# Altium project PCB_Project1.PrjPCB
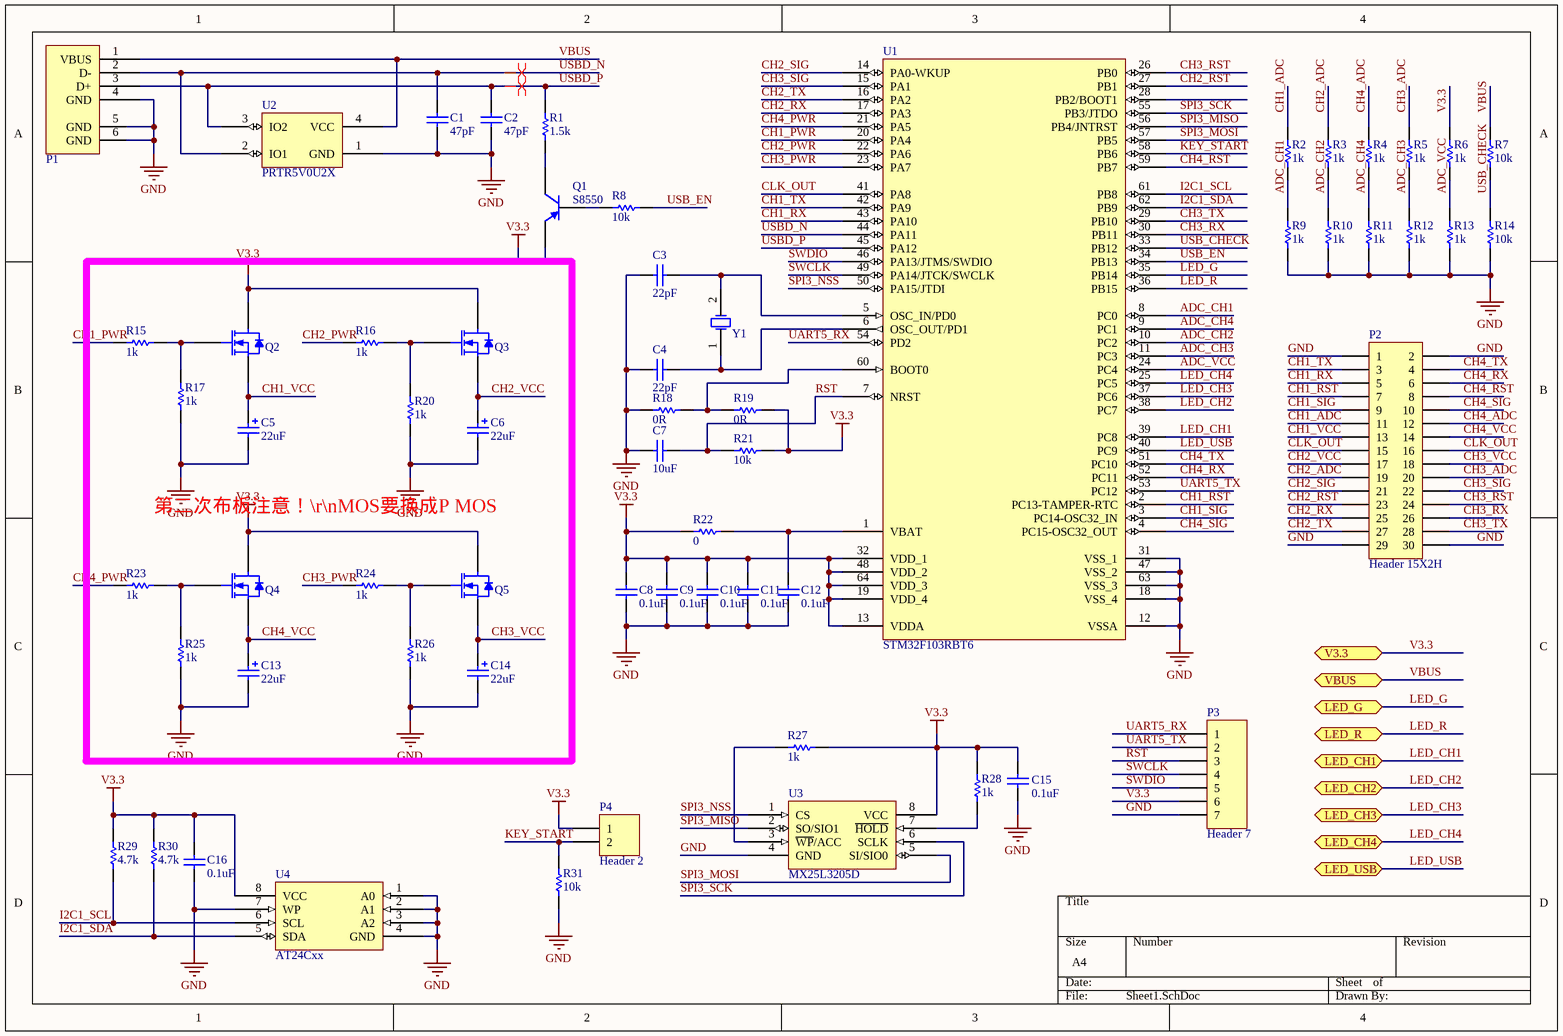
[diagram p0: Sheet1.SchDoc]
2 sheets, 106 parts. Net scope: flat (ports and power ports of the same name join across sheets).
Board file: PCB1.PcbDoc
Sheets:
  Sheet1.SchDoc
  Sheet2.SchDoc

## Sheet Sheet1.SchDoc
size A4

### Parts
C1  value 47pF  [0805]  (hidden comment: Cap)
C2  value 47pF  [0805]  (hidden comment: Cap)
C3  value 22pF  [0805]  (hidden comment: Cap)
C4  value 22pF  [0805]  (hidden comment: Cap)
C5  value 22uF  [0805A]  (hidden comment: Cap)
C6  value 22uF  [0805A]  (hidden comment: Cap)
C7  value 10uF  [0805]  (hidden comment: Cap)
C8  value 0.1uF  [0805]  (hidden comment: Cap)
C9  value 0.1uF  [0805]  (hidden comment: Cap)
C10  value 0.1uF  [0805]  (hidden comment: Cap)
C11  value 0.1uF  [0805]  (hidden comment: Cap)
C12  value 0.1uF  [0805]  (hidden comment: Cap)
C13  value 22uF  [0805A]  (hidden comment: Cap)
C14  value 22uF  [0805A]  (hidden comment: Cap)
C15  value 0.1uF  [0805]  (hidden comment: Cap)
C16  value 0.1uF  [0805]  (hidden comment: Cap)
P1  USB  [USB_B_FE]  (value not drawn)
P2  Header 15X2H  [HDR2X15H]
P3  Header 7  [HDR1X7]
P4  Header 2  [HDR1X2]
Q1  S8550  [SOT-23]
Q2  N-MOS  [SOT-23]  (value not drawn)
Q3  N-MOS  [SOT-23]  (value not drawn)
Q4  N-MOS  [SOT-23]  (value not drawn)
Q5  N-MOS  [SOT-23]  (value not drawn)
R1  value 1.5k  [0805]  (hidden comment: Res)
R2  value 1k  [0805]  (hidden comment: Res)
R3  value 1k  [0805]  (hidden comment: Res)
R4  value 1k  [0805]  (hidden comment: Res)
R5  value 1k  [0805]  (hidden comment: Res)
R6  value 1k  [0805]  (hidden comment: Res)
R7  value 10k  [0805]  (hidden comment: Res)
R8  value 10k  [0805]  (hidden comment: Res)
R9  value 1k  [0805]  (hidden comment: Res)
R10  value 1k  [0805]  (hidden comment: Res)
R11  value 1k  [0805]  (hidden comment: Res)
R12  value 1k  [0805]  (hidden comment: Res)
R13  value 1k  [0805]  (hidden comment: Res)
R14  value 10k  [0805]  (hidden comment: Res)
R15  value 1k  [0805]  (hidden comment: Res)
R16  value 1k  [0805]  (hidden comment: Res)
R17  value 1k  [0805]  (hidden comment: Res)
R18  value 0R  [0805]  (hidden comment: Res)
R19  value 0R  [0805]  (hidden comment: Res)
R20  value 1k  [0805]  (hidden comment: Res)
R21  value 10k  [0805]  (hidden comment: Res)
R22  value 0  [0805]  (hidden comment: Res)
R23  value 1k  [0805]  (hidden comment: Res)
R24  value 1k  [0805]  (hidden comment: Res)
R25  value 1k  [0805]  (hidden comment: Res)
R26  value 1k  [0805]  (hidden comment: Res)
R27  value 1k  [0805]  (hidden comment: Res)
R28  value 1k  [0805]  (hidden comment: Res)
R29  value 4.7k  [0805]  (hidden comment: Res)
R30  value 4.7k  [0805]  (hidden comment: Res)
R31  value 10k  [0805]  (hidden comment: Res)
U1  STM32F103RBT6  [LQFP64_M]
U2  PRTR5V0U2X  [SOT143B]
U3  MX25L3205D  [SOP-8]
U4  AT24Cxx  [SOP-8]
Y1  XTAL2  [SP_XTAL]  (value not drawn)

### Blocks framed on the sheet
第二次布板注意！\r\nMOS要换成P MOS: C5 C6 C13 C14 Q2-Q5 R15-R17 R20 R23-R26

### Ports
LED_CH1, LED_CH2, LED_CH3, LED_CH4, LED_G, LED_R, LED_USB, V3.3, VBUS

### Nets
GND: C1.1 C2.1 C3.1 C4.2 C5.2 C6.2 C7.2 C8.1 C9.1 C10.1 C11.1 C12.1 C13.2 C14.2 C15.1 C16.1 P1.4(GND) P1.5(GND) P1.6(GND) P2.1 P2.2 P2.29 P2.30 P3.7 R9.1 R10.1 R11.1 R12.1 R13.1 R14.1 R17.1 R18.1 R20.2 R25.1 R26.2 R31.1 U1.12(VSSA) U1.18(VSS_4) U1.31(VSS_1) U1.47(VSS_2) U1.63(VSS_3) U2.1(GND) U3.4(GND) U4.1(A0) U4.2(A1) U4.3(A2) U4.4(GND) U4.7(WP)
V3.3: C8.2 C9.2 C10.2 C11.2 C15.2 C16.2 P3.6 P4.1 Q1.2(E) Q2.3(D) Q3.3(D) Q4.3(D) Q5.3(D) R6.2 R19.2 R21.1 R22.1 R27.2 R28.2 R29.2 R30.2 U1.13(VDDA) U1.19(VDD_4) U1.32(VDD_1) U1.48(VDD_2) U1.64(VDD_3) U3.8(VCC) U4.8(VCC) ; port V3.3
ADC_CH1: R2.1 R9.2 U1.8(PC0)
ADC_CH2: R3.1 R10.2 U1.10(PC2)
ADC_CH3: R5.1 R12.2 U1.11(PC3)
ADC_CH4: R4.1 R11.2 U1.9(PC1)
ADC_VCC: R6.1 R13.2 U1.24(PC4)
CH1_ADC: P2.11 R2.2
CH1_PWR: R15.1 U1.20(PA4)
CH1_RST: P2.7 U1.2(PC13-TAMPER-RTC)
CH1_RX: P2.5 U1.43(PA10)
CH1_SIG: P2.9 U1.3(PC14-OSC32_IN)
CH1_TX: P2.3 U1.42(PA9)
CH1_VCC: C5.1 P2.13 Q2.2(S)
CH2_ADC: P2.19 R3.2
CH2_PWR: R16.2 U1.22(PA6)
CH2_RST: P2.23 U1.27(PB1)
CH2_RX: P2.25 U1.17(PA3)
CH2_SIG: P2.21 U1.14(PA0-WKUP)
CH2_TX: P2.27 U1.16(PA2)
CH2_VCC: C6.1 P2.17 Q3.2(S)
CH3_ADC: P2.20 R5.2
CH3_PWR: R24.2 U1.23(PA7)
CH3_RST: P2.24 U1.26(PB0)
CH3_RX: P2.26 U1.30(PB11)
CH3_SIG: P2.22 U1.15(PA1)
CH3_TX: P2.28 U1.29(PB10)
CH3_VCC: C14.1 P2.18 Q5.2(S)
CH4_ADC: P2.12 R4.2
CH4_PWR: R23.1 U1.21(PA5)
CH4_RST: P2.8 U1.59(PB7)
CH4_RX: P2.6 U1.52(PC11)
CH4_SIG: P2.10 U1.4(PC15-OSC32_OUT)
CH4_TX: P2.4 U1.51(PC10)
CH4_VCC: C13.1 P2.14 Q4.2(S)
CLK_OUT: P2.15 P2.16 U1.41(PA8)
I2C1_SCL: R29.1 U1.61(PB8) U4.6(SCL)
I2C1_SDA: R30.1 U1.62(PB9) U4.5(SDA)
KEY_START: P4.2 R31.2 U1.58(PB6)
LED_CH1: U1.39(PC8) ; port LED_CH1
LED_CH2: U1.38(PC7) ; port LED_CH2
LED_CH3: U1.37(PC6) ; port LED_CH3
LED_CH4: U1.25(PC5) ; port LED_CH4
LED_G: U1.35(PB14) ; port LED_G
LED_R: U1.36(PB15) ; port LED_R
LED_USB: U1.40(PC9) ; port LED_USB
RST: C7.1 P3.3 R21.2 U1.7(NRST)
SPI3_MISO: U1.56(PB4/JNTRST) U3.2(SO/SIO1)
SPI3_MOSI: U1.57(PB5) U3.5(SI/SIO0)
SPI3_NSS: U1.50(PA15/JTDI) U3.1(CS)
SPI3_SCK: U1.55(PB3/JTDO) U3.6(SCLK)
SWCLK: P3.4 U1.49(PA14/JTCK/SWCLK)
SWDIO: P3.5 U1.46(PA13/JTMS/SWDIO)
UART5_RX: P3.1 U1.54(PD2)
UART5_TX: P3.2 U1.53(PC12)
USB_CHECK: R7.1 R14.2 U1.33(PB12)
USB_EN: R8.2 U1.34(PB13)
USBD_N: C1.2 P1.2(D-) U1.44(PA11) U2.2(IO1)
USBD_P: C2.2 P1.3(D+) R1.2 U1.45(PA12) U2.3(IO2)
VBUS: P1.1(VBUS) R7.2 U2.4(VCC) ; port VBUS
NetC3_2: C3.2 U1.5(OSC_IN/PD0) Y1.2(OSC2)
NetC4_1: C4.1 U1.6(OSC_OUT/PD1) Y1.1(OSC1)
NetC12_2: C12.2 R22.2 U1.1(VBAT)
NetQ1_1: Q1.1(B) R8.1
NetQ1_3: Q1.3(C) R1.1
NetQ2_1: Q2.1(G) R15.2 R17.2
NetQ3_1: Q3.1(G) R16.1 R20.1
NetQ4_1: Q4.1(G) R23.2 R25.2
NetQ5_1: Q5.1(G) R24.1 R26.1
NetR18_2: R18.2 R19.1 U1.60(BOOT0)
NetR27_1: R27.1 U3.3(~{WP}/ACC)
NetR28_1: R28.1 U3.7(~{HOLD})

Not connected (* = marked no-connect by the designer): U1 28(PB2/BOOT1)

### Layout directives
differential pair: USBD_N, USBD_P

### Library data of the parts
C5 C6 C13 C14 = Cap Pol
P1 = USB Socket
P2 = Header 15X2H: Header, 15-Pin, Dual row, Right Angle; LatestRevisionDate: 17-Jul-2002; LatestRevisionNote: Re-released for DXP Platform.; Publisher: Altium Limited
P3 = Header 7: Header, 7-Pin; LatestRevisionDate: 17-Jul-2002; LatestRevisionNote: Re-released for DXP Platform.; Publisher: Altium Limited
P4 = Header 2: Header, 2-Pin; LatestRevisionDate: 17-Jul-2002; LatestRevisionNote: Re-released for DXP Platform.; Publisher: Altium Limited
U1 = STM32F103RBT6: STM32 ARM-based 32-bit MCU with 128 Kbytes Flash, 64-pin LQFP, Industrial Temperature; Published: 30-May-2008; DatasheetVersion: rev6, Mar-2008; PackageVersion: Mar-2008; PackageReference: LQFP64; Publisher: Altium Limited; PackageDescription: 64-Pin Low-Profile Quad Flat Pack, 10 x 10 mm Body, 0.5 mm Pitch (LQFP64); ComponentLink1Description: Manufacturer Link; ComponentLink1URL: www.st.com/stm32; ComponentLink2Description: Datasheet; ComponentLink2URL: http://www.st.com/stonline/products/literature/ds/13587.pdf
U3 = MX25L1605D/MX25L3205D/MX25L6405D
Y1 = XTAL2: Value: 12MHz

## Sheet Sheet2.SchDoc
size A4
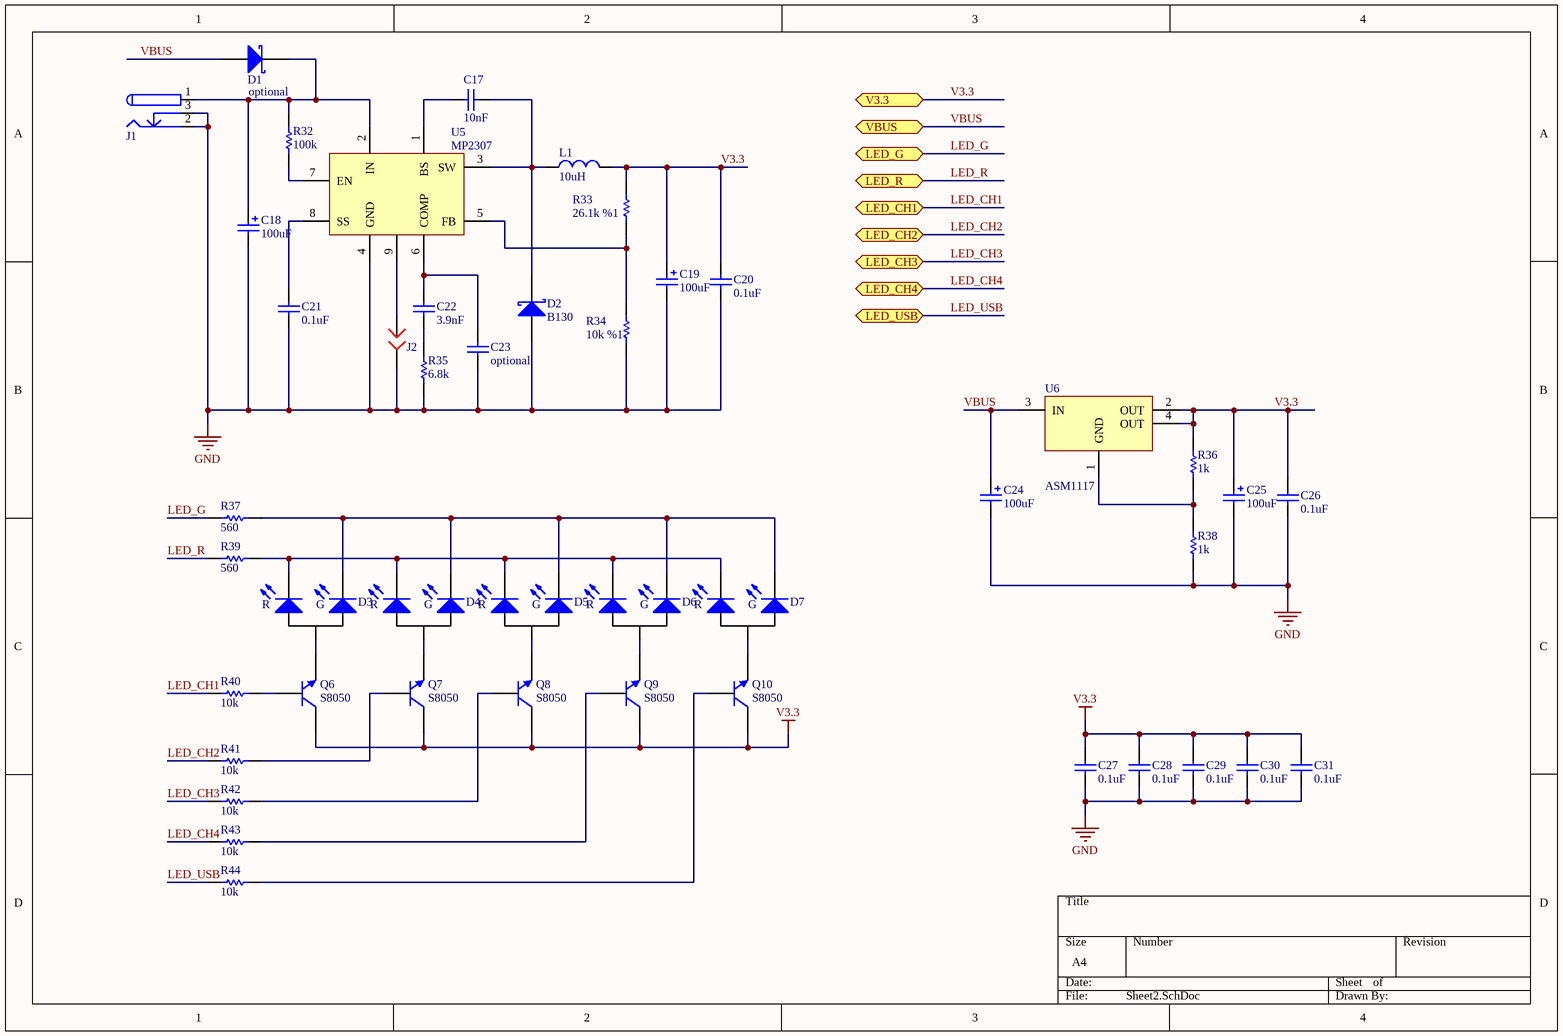
[diagram p1: Sheet2.SchDoc]

### Parts
C17  value 10nF  [0805]  (hidden comment: Cap)
C18  value 100uF  [1206A]  (hidden comment: Cap)
C19  value 100uF  [1206A]  (hidden comment: Cap)
C20  value 0.1uF  [0805]  (hidden comment: Cap)
C21  value 0.1uF  [0805]  (hidden comment: Cap)
C22  value 3.9nF  [0805]  (hidden comment: Cap)
C23  value optional  [0805]  (hidden comment: Cap)
C24  value 100uF  [0805A]  (hidden comment: Cap)
C25  value 100uF  [0805A]  (hidden comment: Cap)
C26  value 0.1uF  [0805]  (hidden comment: Cap)
C27  value 0.1uF  [0805]  (hidden comment: Cap)
C28  value 0.1uF  [0805]  (hidden comment: Cap)
C29  value 0.1uF  [0805]  (hidden comment: Cap)
C30  value 0.1uF  [0805]  (hidden comment: Cap)
C31  value 0.1uF  [0805]  (hidden comment: Cap)
D1  optional  [SMA_DO-241AC]
D2  B130  [SMA_DO-241AC]
D3  LED  [LED-D]  (value not drawn)
D4  LED  [LED-D]  (value not drawn)
D5  LED  [LED-D]  (value not drawn)
D6  LED  [LED-D]  (value not drawn)
D7  LED  [LED-D]  (value not drawn)
J1  PowerSocket  [SP_PWR]  (value not drawn)
J2  Jump  [SP_JUMP]  (value not drawn)
L1  value 10uH  [GD4520/4532]  (hidden comment: Inductance)
Q6  S8050  [SOT-23]
Q7  S8050  [SOT-23]
Q8  S8050  [SOT-23]
Q9  S8050  [SOT-23]
Q10  S8050  [SOT-23]
R32  value 100k  [0805]  (hidden comment: Res)
R33  value 26.1k %1  [0805]  (hidden comment: Res)
R34  value 10k %1  [0805]  (hidden comment: Res)
R35  value 6.8k  [0805]  (hidden comment: Res)
R36  value 1k  [0805]  (hidden comment: Res)
R37  value 560  [0805]  (hidden comment: Res)
R38  value 1k  [0805]  (hidden comment: Res)
R39  value 560  [0805]  (hidden comment: Res)
R40  value 10k  [0805]  (hidden comment: Res)
R41  value 10k  [0805]  (hidden comment: Res)
R42  value 10k  [0805]  (hidden comment: Res)
R43  value 10k  [0805]  (hidden comment: Res)
R44  value 10k  [0805]  (hidden comment: Res)
U5  MP2307  [SOIC8N]
U6  ASM1117  [SOT-223]

### Ports
LED_CH1, LED_CH2, LED_CH3, LED_CH4, LED_G, LED_R, LED_USB, V3.3, VBUS

### Nets
GND: C18.2 C19.2 C20.1 C21.1 C23.1 C24.2 C25.2 C26.1 C27.1 C28.1 C29.1 C30.1 C31.1 D2.1(A) J1.2(K) J1.3(K_NC) J2.1(C1) R34.1 R35.1 R38.1 U5.4(GND)
V3.3: C19.1 C20.2 C25.1 C26.2 C27.2 C28.2 C29.2 C30.2 C31.2 L1.2 Q6.3(C) Q7.3(C) Q8.3(C) Q9.3(C) Q10.3(C) R33.2 R36.2 U6.2(OUT) U6.4(OUT) ; port V3.3
LED_CH1: R40.2 ; port LED_CH1
LED_CH2: R41.2 ; port LED_CH2
LED_CH3: R42.2 ; port LED_CH3
LED_CH4: R43.2 ; port LED_CH4
LED_G: R37.1 ; port LED_G
LED_R: R39.1 ; port LED_R
LED_USB: R44.1 ; port LED_USB
VBUS: C24.1 D1.1(A) U6.3(IN) ; port VBUS
NetC17_1: C17.1 U5.1(BS)
NetC17_2: C17.2 D2.2(K) L1.1 U5.3(SW)
NetC18_1: C18.1 D1.2(K) J1.1(A) R32.2 U5.2(IN)
NetC21_2: C21.2 U5.8(SS)
NetC22_1: C22.1 R35.2
NetC22_2: C22.2 C23.2 U5.6(COMP)
NetD3_1: D3.1(K1) D4.1(K1) D5.1(K1) D6.1(K1) D7.1(K1) R39.2
NetD3_2: D3.2(A) Q6.2(E)
NetD3_3: D3.3(K2) D4.3(K2) D5.3(K2) D6.3(K2) D7.3(K2) R37.2
NetD4_2: D4.2(A) Q7.2(E)
NetD5_2: D5.2(A) Q8.2(E)
NetD6_2: D6.2(A) Q9.2(E)
NetD7_2: D7.2(A) Q10.2(E)
NetJ2_2: J2.2(C2) U5.9(ExPad)
NetQ6_1: Q6.1(B) R40.1
NetQ7_1: Q7.1(B) R41.1
NetQ8_1: Q8.1(B) R42.1
NetQ9_1: Q9.1(B) R43.1
NetQ10_1: Q10.1(B) R44.2
NetR32_1: R32.1 U5.7(EN)
NetR33_1: R33.1 R34.2 U5.5(FB)
NetR36_1: R36.1 R38.2 U6.1(GND)

### Notes on the sheet
- (in symbol LED2) R; G

### Library data of the parts
C18 C19 C24 C25 = Cap Pol
D1 D2 = Diode 2
D3-D7 = LED2
J1 = PWR: Power Socket

## Nets that join several sheets
GND: Sheet1 (48 pins), Sheet2 (21 pins)
V3.3: Sheet1 (28 pins), Sheet2 (19 pins)
LED_CH1: Sheet1 (U1.39), Sheet2 (R40.2)
LED_CH2: Sheet1 (U1.38), Sheet2 (R41.2)
LED_CH3: Sheet1 (U1.37), Sheet2 (R42.2)
LED_CH4: Sheet1 (U1.25), Sheet2 (R43.2)
LED_G: Sheet1 (U1.35), Sheet2 (R37.1)
LED_R: Sheet1 (U1.36), Sheet2 (R39.1)
LED_USB: Sheet1 (U1.40), Sheet2 (R44.1)
VBUS: Sheet1 (P1.1 R7.2 U2.4), Sheet2 (C24.1 D1.1 U6.3)